# EAGLE design RAMI (EAGLE 9.3.0)
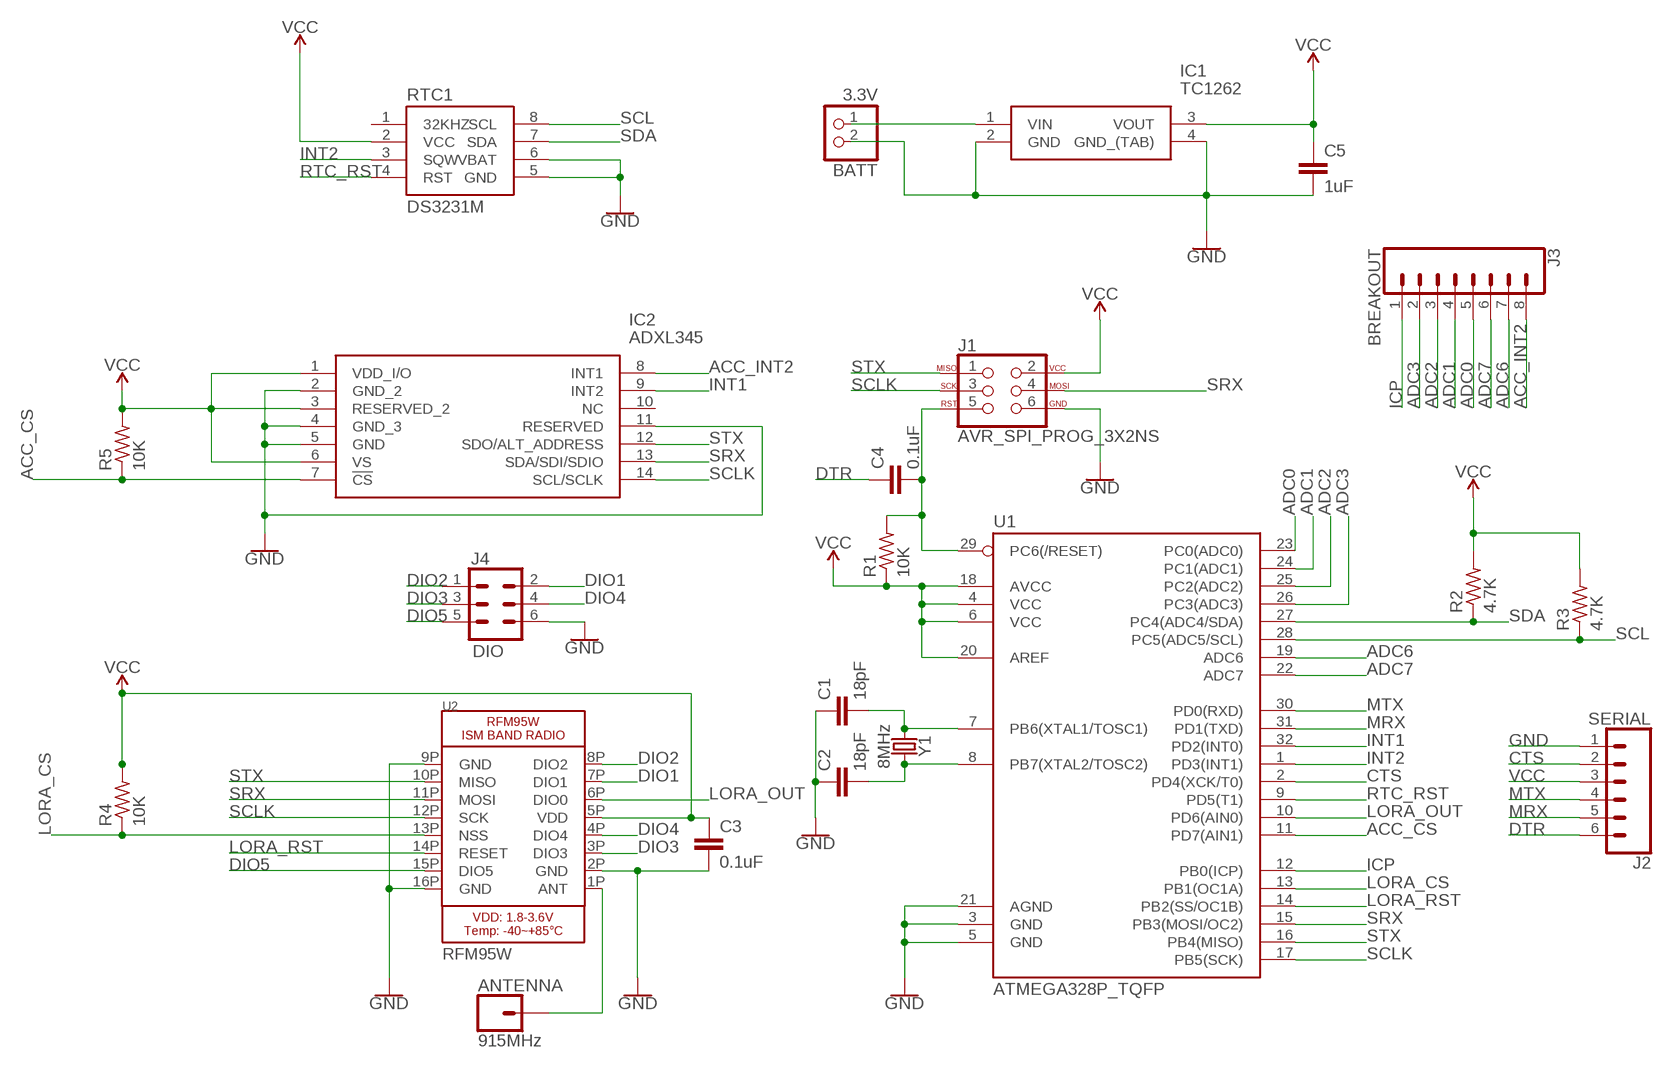
[diagram p0: schematic, sheet 1]

## Parts
ANTENNA  915MHz  CONN_01  [1X01]
BATT  3.3V  JST_2PIN-THM  [JST-PH-2-THM]
C1  18pF  18PF-0603-50V-5%  [0603]
C2  18pF  18PF-0603-50V-5%  [0603]
C3  0.1uF  0.1UF-0603-25V-5%  [0603]
C4  0.1uF  0.1UF-0603-25V-5%  [0603]
C5  1uF  C-EU050-024X044  [C050-024X044]
IC1  TC1262  TC1262-3.3VDB  [SOT230P700X180-4N]
IC2  ADXL345  ADXL345BCCZ  [LGA14R80P3X6_300X500X100]
J1  AVR_SPI_PROG_3X2NS  [2X3-NS]
J2  SERIAL  CONN_06LOCK  [1X06_LOCK]
J3  BREAKOUT  CONN_08"  [1X08]
J4  DIO  CONN_03X2NO_SILK  [2X3-NS]
R1  10K  R-US_R0603  [R0603]
R2  4.7K  R-US_R0603  [R0603]
R3  4.7K  R-US_R0603  [R0603]
R4  10K  R-US_R0603  [R0603]
R5  10K  R-US_R0603  [R0603]
RTC1  DS3231M  [SO08]
U1  ATMEGA328P_TQFP  [TQFP32-08]
U2  RFM95W  RFM95W_SMT  [RFM95W_SMT]
Y1  8MHz  CRYSTALPTH-HC49US  [HC49US]

## Nets
ACC_CS: IC2.7(!CS) R5.1 U1.11(PD7(AIN1))
ACC_INT2: IC2.8(INT1) J3.8
ADC0: J3.5 U1.23(PC0(ADC0))
ADC1: J3.4 U1.24(PC1(ADC1))
ADC2: J3.3 U1.25(PC2(ADC2))
ADC3: J3.2 U1.26(PC3(ADC3))
ADC6: J3.7 U1.19(ADC6)
ADC7: J3.6 U1.22(ADC7)
ANT: ANTENNA.1 U2.1P(ANT)
CTS: J2.2 U1.2(PD4(XCK/T0))
DIO1: J4.2 U2.7P(DIO1)
DIO2: J4.1 U2.8P(DIO2)
DIO3: J4.3 U2.3P(DIO3)
DIO4: J4.4 U2.4P(DIO4)
DIO5: J4.5 U2.15P(DIO5)
DTR: C4.1 J2.6
GND: BATT.2 C1.1 C2.1 C3.2 C5.2 IC1.2(GND) IC1.4(GND_(TAB)) IC2.2(GND_2) IC2.4(GND_3) IC2.5(GND) IC2.11(RESERVED) J1.6 J2.1 J4.6 RTC1.5(GND) RTC1.6(VBAT) U1.3(GND) U1.5(GND) U1.21(AGND) U2.2P(GND) U2.9P(GND) U2.16P(GND)
ICP: J3.1 U1.12(PB0(ICP))
INT1: IC2.9(INT2) U1.32(PD2(INT0))
INT2: RTC1.3(SQW) U1.1(PD3(INT1))
LORA_CS: R4.1 U1.13(PB1(OC1A)) U2.13P(NSS)
LORA_OUT: U1.10(PD6(AIN0)) U2.6P(DIO0)
LORA_RST: U1.14(PB2(SS/OC1B)) U2.14P(RESET)
MRX: J2.5 U1.31(PD1(TXD))
MTX: J2.4 U1.30(PD0(RXD))
N$2: C1.2 U1.7(PB6(XTAL1/TOSC1)) Y1.1
N$3: C2.2 U1.8(PB7(XTAL2/TOSC2)) Y1.2
N$4: BATT.1 IC1.1(VIN)
RST: C4.2 J1.5 R1.2 U1.29(PC6(/RESET))
RTC_RST: RTC1.4(RST) U1.9(PD5(T1))
SCL: R3.1 RTC1.8(SCL) U1.28(PC5(ADC5/SCL))
SCLK: IC2.14(SCL/SCLK) J1.3 U1.17(PB5(SCK)) U2.12P(SCK)
SDA: R2.1 RTC1.7(SDA) U1.27(PC4(ADC4/SDA))
SRX: IC2.13(SDA/SDI/SDIO) J1.4 U1.15(PB3(MOSI/OC2)) U2.11P(MOSI)
STX: IC2.12(SDO/ALT_ADDRESS) J1.1 U1.16(PB4(MISO)) U2.10P(MISO)
VCC: C3.1 C5.1 IC1.3(VOUT) IC2.1(VDD_I/O) IC2.3(RESERVED_2) IC2.6(VS) J1.2 J2.3 R1.1 R2.2 R3.2 R4.2 R5.2 RTC1.2(VCC) U1.4(VCC) U1.6(VCC) U1.18(AVCC) U1.20(AREF) U2.5P(VDD)
Unconnected: IC2.10(NC) RTC1.1(32KHZ)

## Library data of the parts
ANTENNA = SparkFun-Connectors:CONN_01: Single connection point. Often used as Generic Header-pin footprint for 0.1 inch spaced/style header connections On any of the 0.1 inch spaced packages, you can populate with these: Break Away Headers - Straight <https://www.sparkfun.com/products/116> (PRT-00116) Break Away Male Headers - Right Angle <https://www.sparkfun.com/products/553> (PRT-00553) Female Headers <https://www.sparkfun.com/products/115> (PRT-00115) Break Away Headers - Machine Pin <https://www.sparkfun.com/products/117> (PRT-00117) Break Away Female Headers - Swiss Machine Pin <https://www.sparkfun.com/products/743> (PRT-00743) This device is also useful as a general connection point to wire up your design to another part of your project. Our various solder wires solder well into these plated through hole pads. Hook-Up Wire - Assortment (Stranded, 22 AWG) <https://www.sparkfun.com/products/11375> (PRT-11375) Hook-Up Wire - Assortment (Solid Core, 22 AWG) <https://www.sparkfun.com/products/11367> (PRT-11367) View the entire wire category on our website here <https://www.sparkfun.com/categories/141> Special notes: SMTSO-256-ET is a "flush mount" nut for a 4-40 screw. We mostly use this on specialty testbeds; it is a nice way to connect hardware to your PCB at an adjustable hieght. Also note, the SNAP packages are for using a snappable style connector. We sell a baggie of snaps and they are also used on two LilyPad designs: Snap Assortment - 30 pack (male and female) <https://www.sparkfun.com/products/11347> (DEV-11347) LilyPad Arduino SimpleSnap <https://www.sparkfun.com/products/10941> (DEV-10941) LilyPad SimpleSnap Protoboard <https://www.sparkfun.com/products/10940> (DEV-10940)
BATT = adafruit:JST_2PIN: JST 2-Pin Connectors of various flavors SMT-RA (S2B-PH-SM4) 4UConnector #17311 SMT (B2B-PH-SM4) THM-RA (S2B-PH) THM (B2B-PH)
C1 C2 = SparkFun-Capacitors:18PF: 18pF ceramic capacitors A capacitor is a passive two-terminal electrical component used to store electrical energy temporarily in an electric field.; PROD_ID: CAP-08267
C3 C4 = SparkFun-Capacitors:0.1UF: 0.1µF ceramic capacitors A capacitor is a passive two-terminal electrical component used to store electrical energy temporarily in an electric field.; PROD_ID: CAP-08604
C5 = resistor:C-EU: CAPACITOR, European symbol
IC1 = SamacSys_Parts:TC1262-3.3VDB: TC1262-3.3VDB, Low Dropout Voltage Regulator, 0.5A, 3.3 V +/-0.5%, 2.7 6 Vin, 3-Pin SOT-223 Source: Datasheet <http://ww1.microchip.com/downloads/en/DeviceDoc/21373C.pdf>; ALLIED_NUMBER: 70414587; ALLIED_PRICE-STOCK: http://www.alliedelec.com/microchip-technology-inc-tc1262-3-3vdb/70414587/; DESCRIPTION: TC1262-3.3VDB, Low Dropout Voltage Regulator, 0.5A, 3.3 V +/-0.5%, 2.7 6 Vin, 3-Pin SOT-223; HEIGHT: 1.8mm; MANUFACTURER_NAME: Microchip; MANUFACTURER_PART_NUMBER: TC1262-3.3VDB; MOUSER_PART_NUMBER: 579-TC1262-3.3VDB; MOUSER_PRICE-STOCK: https://www.mouser.com/Search/Refine.aspx?Keyword=579-TC1262-3.3VDB; RS_PART_NUMBER: 9115732; RS_PRICE-STOCK: http://uk.rs-online.com/web/p/products/9115732
IC2 = SamacSys_Parts:ADXL345BCCZ: ADXL345BCCZ, Accelerometer 3-Axis, 0.1 3200 Hz 2 3.6 V, 14-Pin LGA Source: Datasheet <http://componentsearchengine.com/Datasheets/1/ADXL345BCCZ.pdf>; DESCRIPTION: ADXL345BCCZ, Accelerometer 3-Axis, 0.1 3200 Hz 2 3.6 V, 14-Pin LGA; HEIGHT: mm; MANUFACTURER_NAME: Analog Devices; MANUFACTURER_PART_NUMBER: ADXL345BCCZ; MOUSER_PART_NUMBER: 584-ADXL345BCCZ; MOUSER_PRICE-STOCK: https://www.mouser.com/Search/Refine.aspx?Keyword=584-ADXL345BCCZ; RS_PART_NUMBER: 7098439P; RS_PRICE-STOCK: http://uk.rs-online.com/web/p/products/7098439P
J1 = SparkFun-Connectors:AVR_SPI_PROG_3X2: AVR ISP 6 Pin This is the reduced ISP connector for AVR programming. Common on Arduino. This footprint will take up less PCB space and can be used with a 10-pin to 6-pin adapter such as SKU: BOB-08508 **Special note about "TEST_POINT" package. The stop mask is on the top side, so if you want your programming test points to be on the bottom of your board, make sure to place this package on the bottom side of the board. This also ensure that the orientation to program from the bottom side will be correct. SparkFun Products: SparkFun ISP Pogo Adapter <https://www.sparkfun.com/products/11591> - NS Tiny AVR Programmer <https://www.sparkfun.com/products/11801> -PTH
J2 = SparkFun-Connectors:CONN_06: Multi connection point. Often used as Generic Header-pin footprint for 0.1 inch spaced/style header connections On any of the 0.1 inch spaced packages, you can populate with these: Break Away Headers - Straight <https://www.sparkfun.com/products/116> (PRT-00116) Break Away Male Headers - Right Angle <https://www.sparkfun.com/products/553> (PRT-00553) Female Headers <https://www.sparkfun.com/products/115> (PRT-00115) Break Away Headers - Machine Pin <https://www.sparkfun.com/products/117> (PRT-00117) Break Away Female Headers - Swiss Machine Pin <https://www.sparkfun.com/products/743> (PRT-00743) Arduino Stackable Header - 6 Pin <https://www.sparkfun.com/products/9280> (PRT-09280) For SCREWTERMINALS and SPRING TERMINALS visit here: Screw Terimnals on SparkFun.com <https://www.sparkfun.com/search/results?term=Screw+Terminals> (5mm/3.5mm/2.54mm spacing) This device is also useful as a general connection point to wire up your design to another part of your project. Our various solder wires solder well into these plated through hole pads. Hook-Up Wire - Assortment (Stranded, 22 AWG) <https://www.sparkfun.com/products/11375> (PRT-11375) Hook-Up Wire - Assortment (Solid Core, 22 AWG) <https://www.sparkfun.com/products/11367> (PRT-11367) View the entire wire category on our website here <https://www.sparkfun.com/categories/141>
J3 = SparkFun-Connectors:CONN_08: Multi connection point. Often used as Generic Header-pin footprint for 0.1 inch spaced/style header connections On any of the 0.1 inch spaced packages, you can populate with these: Break Away Headers - Straight <https://www.sparkfun.com/products/116> (PRT-00116) Break Away Male Headers - Right Angle <https://www.sparkfun.com/products/553> (PRT-00553) Female Headers <https://www.sparkfun.com/products/115> (PRT-00115) Break Away Headers - Machine Pin <https://www.sparkfun.com/products/117> (PRT-00117) Break Away Female Headers - Swiss Machine Pin <https://www.sparkfun.com/products/743> (PRT-00743) Arduino Stackable Header - 8 Pin <https://www.sparkfun.com/products/9279> (PRT-09279) For SCREWTERMINALS and SPRING TERMINALS visit here: Screw Terimnals on SparkFun.com <https://www.sparkfun.com/search/results?term=Screw+Terminals> (5mm/3.5mm/2.54mm spacing) This device is also useful as a general connection point to wire up your design to another part of your project. Our various solder wires solder well into these plated through hole pads. Hook-Up Wire - Assortment (Stranded, 22 AWG) <https://www.sparkfun.com/products/11375> (PRT-11375) Hook-Up Wire - Assortment (Solid Core, 22 AWG) <https://www.sparkfun.com/products/11367> (PRT-11367) View the entire wire category on our website here <https://www.sparkfun.com/categories/141> Special notes: Molex polarized connector foot print use with SKU : PRT-08231 with associated crimp pins and housings. 1MM SMD Version SKU: PRT-10208 NOTES ON THE VARIANTS LOCK and LOCK_LONGPADS... This footprint was designed to help hold the alignment of a through-hole component (i.e. 6-pin header) while soldering it into place. You may notice that each hole has been shifted either up or down by 0.005 of an inch from it's more standard position (which is a perfectly straight line). This slight alteration caused the pins (the squares in the middle) to touch the edges of the holes. Because they are alternating, it causes a "brace" to hold the component in place. 0.005 has proven to be the perfect amount of "off-center" position when using our standard breakaway headers. Although looks a little odd when you look at the bare footprint, once you have a header in there, the alteration is very hard to notice. Also,if you push a header all the way into place, it is covered up entirely on the bottom side.; PROD_ID: CONN-08438
J4 = SparkFun-Connectors:CONN_03X2: Multi connection point. Often used as Generic Header-pin footprint for 0.1 inch spaced/style header connections You can populate with any combo of single row headers, but if you'd like an exact match, check these: Header - 2x3 (Male, 0.1") <https://www.sparkfun.com/products/12807> (PRT-12807) Header - 2x3 (Female, 0.1") <https://www.sparkfun.com/products/13010> (PRT-13010) 2x3 Pin Shrouded Header <https://www.sparkfun.com/products/10877> (PRT-10877) On any of the 0.1 inch spaced packages, you can populate with these: Break Away Headers - Straight <https://www.sparkfun.com/products/116> (PRT-00116) Break Away Male Headers - Right Angle <https://www.sparkfun.com/products/553> (PRT-00553) Female Headers <https://www.sparkfun.com/products/115> (PRT-00115) Break Away Headers - Machine Pin <https://www.sparkfun.com/products/117> (PRT-00117) Break Away Female Headers - Swiss Machine Pin <https://www.sparkfun.com/products/743> (PRT-00743) Special note: the shrouded connector mates well with our 3x2 ribbon cables: Ribbon Crimp Connector - 6-pin (2x3, Female) <https://www.sparkfun.com/products/10651> (PRT-10651) Ribbon Cable - 6 wire (15ft) <https://www.sparkfun.com/products/10646> (PRT-10646)
R1-R5 = resistor:R-US_: RESISTOR, American symbol
RTC1 = SparkFun-Clocks:DS3231M: DS3231M Real Time Clock Accuracy +/-5ppm. Battery Backup. 2.3V to 5.5V. Datasheet <https://cdn.sparkfun.com/datasheets/Dev/Beagle/DS3231M.pdf> SparkFun Products CryptoCape <https://www.sparkfun.com/products/12773> (DEV-12773) SparkFun CryptoShield <https://www.sparkfun.com/products/13183> (DEV-13183); PROD_ID: IC-11985
U1 = SparkFun-IC-Microcontroller:ATMEGA328P_TQFP: Popular 328P in QFP Storefront component: ATmega328 - TQFP <https://www.sparkfun.com/products/13448> (COM-13448) Datasheet <http://www.sparkfun.com/datasheets/Components/SMD/ATMega328.pdf> SparkFun Products SparkFun RedBoard - Programmed with Arduino <https://www.sparkfun.com/products/12757> (DEV-12757) Arduino Pro Mini 328 - 5V/16MHz <https://www.sparkfun.com/products/11113> (DEV-11113) Arduino Pro Mini 328 - 3.3V/8MHz <https://www.sparkfun.com/products/11114> (DEV-11114) SparkFun OpenLog <https://www.sparkfun.com/products/13712> (DEV-13712) SparkFun MicroView - OLED Arduino Module <https://www.sparkfun.com/products/12923> (DEV-12923) SparkFun Digital Sandbox <https://www.sparkfun.com/products/12651> (DEV-12651) SparkFun PicoBoard <https://www.sparkfun.com/products/11888> (WIG-11888) Arduino Fio <https://www.sparkfun.com/products/10116> (DEV-10116) LilyPad Arduino 328 Main Board <https://www.sparkfun.com/products/13342> (DEV-13342) SparkFun RedStick <https://www.sparkfun.com/products/13741> (DEV-13741) LilyPad MP3 <https://www.sparkfun.com/products/11013> (DEV-11013) LilyPad Arduino SimpleSnap <https://www.sparkfun.com/products/10941> (DEV-10941) SparkFun Stepoko <https://www.sparkfun.com/products/13899> (ROB-13899) SparkFun Geiger Counter <https://www.sparkfun.com/products/11345> (SEN-11345) SparkFun EL Sequencer <https://www.sparkfun.com/products/12781> (COM-12781) Arduino Pro 328 - 5V/16MHz <https://www.sparkfun.com/products/10915> (DEV-10915) CryptoCape <https://www.sparkfun.com/products/12773> (DEV-12773) SparkFun IR Thermometer Evaluation Board - MLX90614 <https://www.sparkfun.com/products/10740> (SEN-10740) SparkFun RedBot Mainboard <https://www.sparkfun.com/products/12097> (ROB-12097) Arduino Pro 328 - 3.3V/8MHz <https://www.sparkfun.com/products/10914> (DEV-10914) SparkFun Block for Intel® Edison - Arduino <https://www.sparkfun.com/products/13036> (DEV-13036) SparkFun Simon Says - Surface Mount Soldering Kit <https://www.sparkfun.com/products/10935> (KIT-10935) SparkFun 7-Segment Serial Display - Red <https://www.sparkfun.com/products/11441> (COM-11441) SparkFun 7-Segment Serial Display - White <https://www.sparkfun.com/products/11629> (COM-11629) SparkFun 7-Segment Serial Display - Yellow <https://www.sparkfun.com/products/11443> (COM-11443) SparkFun 7-Segment Serial Display - Kelly Green <https://www.sparkfun.com/products/11440> (COM-11440) SparkFun 7-Segment Serial Display - Blue <https://www.sparkfun.com/products/11442> (COM-11442) SparkFun OpenSegment Serial Display - 20mm (Blue) <https://www.sparkfun.com/products/11647> (COM-11647) SparkFun OpenSegment Serial Display - 20mm (Green) <https://www.sparkfun.com/products/11646> (COM-11646) SparkFun OpenSegment Serial Display - 20mm (White) <https://www.sparkfun.com/products/11648> (COM-11648) SparkFun OpenSegment Serial Display - 20mm (Red) <https://www.sparkfun.com/products/11644> (COM-11644) SparkFun OpenSegment Serial Display - 20mm (Yellow) <https://www.sparkfun.com/products/11645> (COM-11645) SparkFun OpenSegment Shield <https://www.sparkfun.com/products/13190> (DEV-13190); PROD_ID: IC-09069
U2 = Personal:RFM95W: RFM69HCW - ISM Band RF Transceiver
Y1 = SparkFun-Clocks:CRYSTAL: Crystals (Generic) These are passive quartz crystals, which can be used as a clock source for a microcontroller. Crystal's are two-terminal devices. They require external "load" capacitors to generate an oscillating signal.

## Net classes
0 default: clearance 0.205 mm

## Board
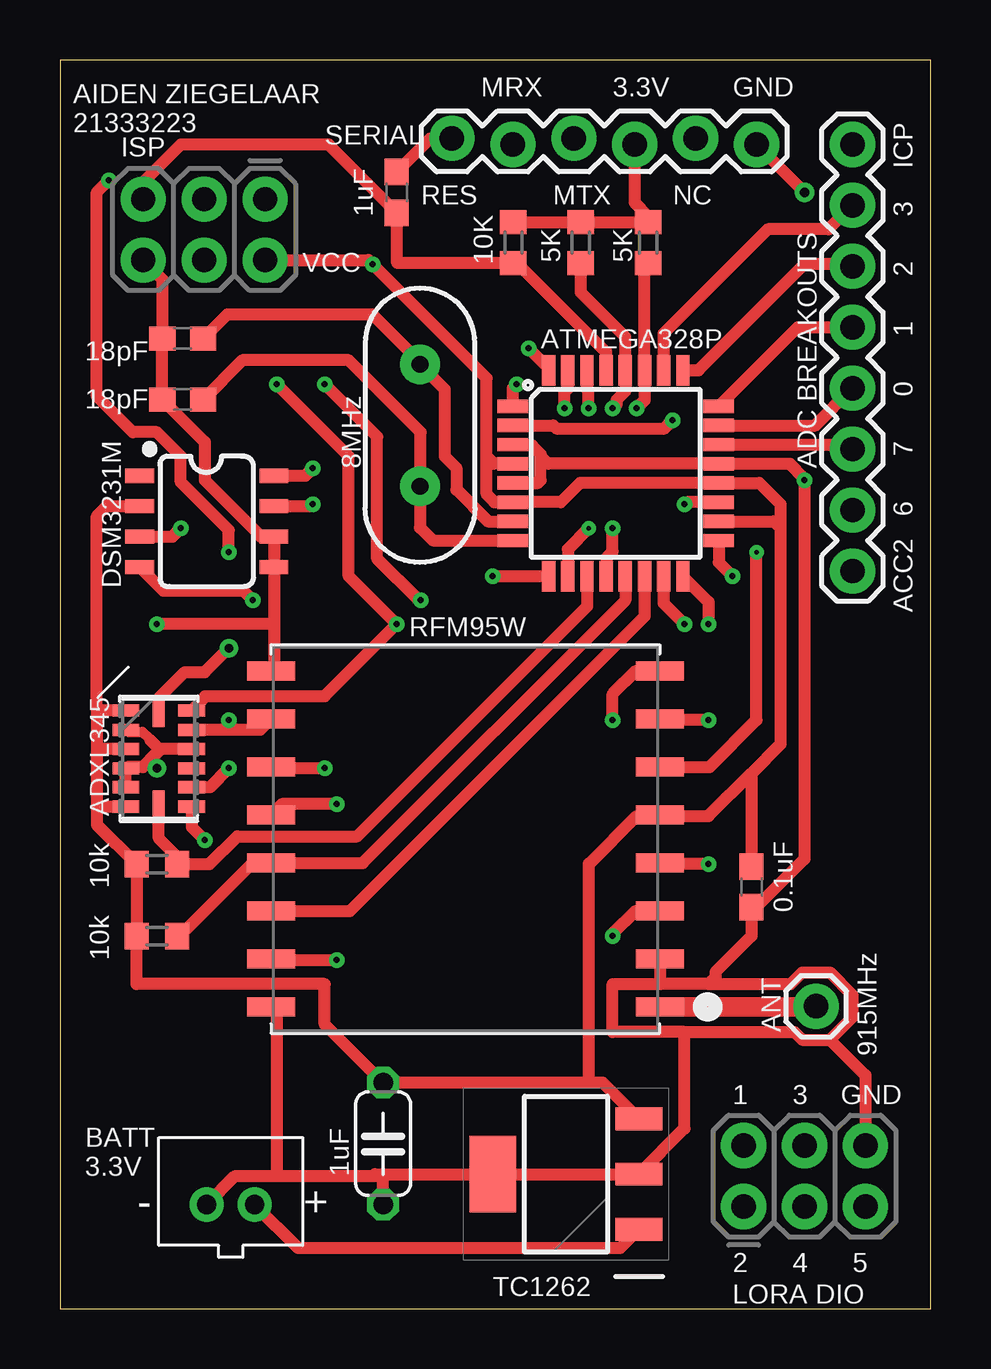
[diagram p1: board, top side]
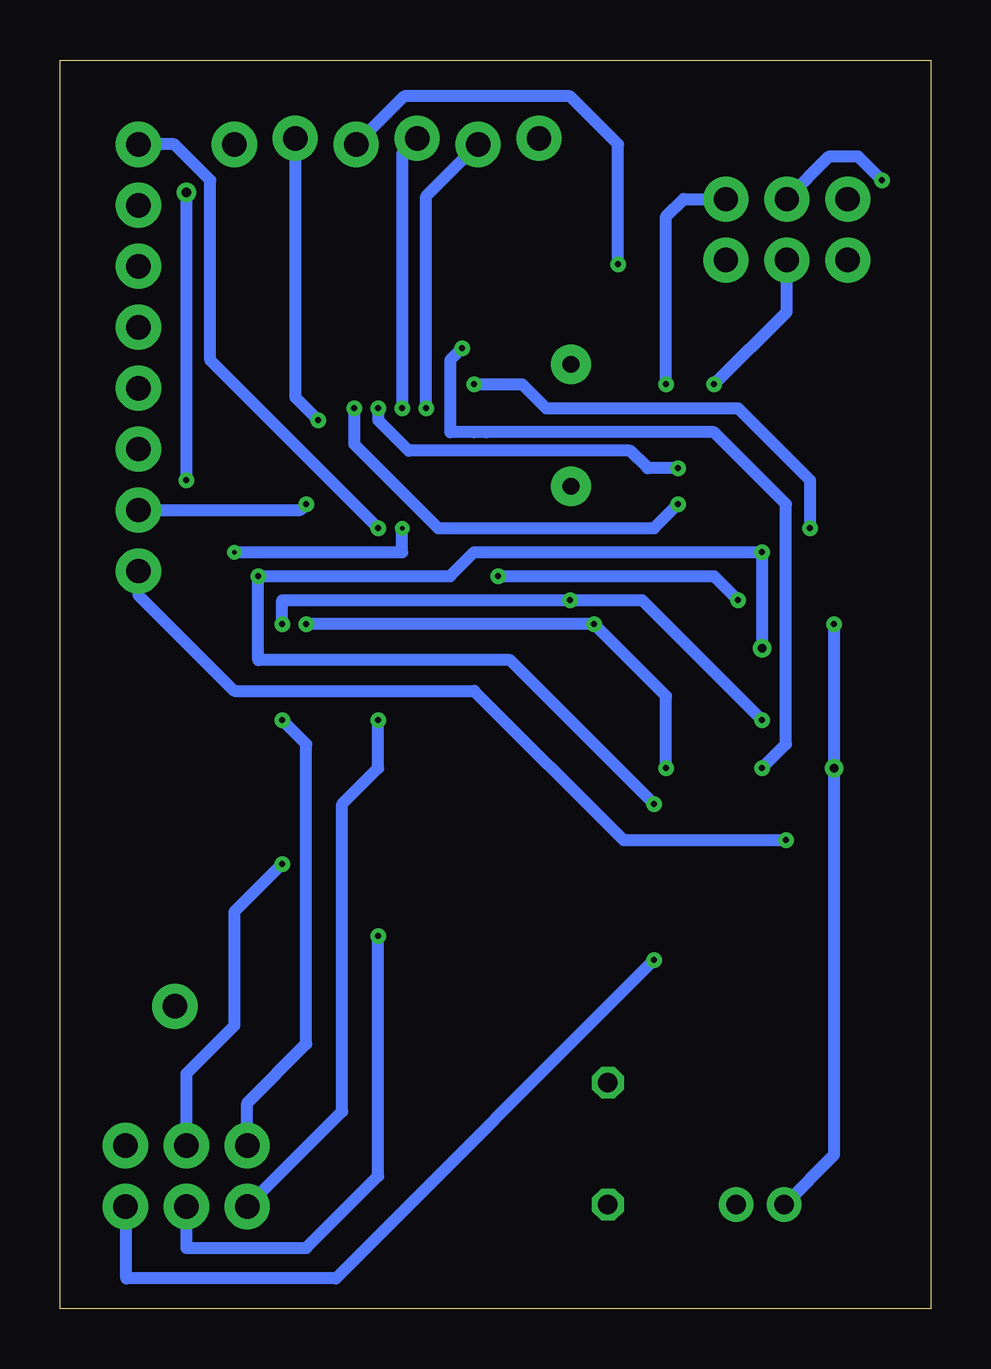
[diagram p2: board, bottom side, seen from below]

Size 36.31 x 52.06 mm. Coordinates in mm from the lower left corner, seen from the top.
Outline: 0,0 36.31,0 36.31,52.06 0,52.06 0,0
Copper layers (1*16): Top 0.035mm / dielectric 1.5mm / Bottom 0.035mm
Design rules "untitled *": minimum track width 20mil, minimum drill 2mil, track to track 10mil, track to pad 0.205mm, pad to pad 0.205mm, via to via 10mil, smd to smd 6mil, copper to edge 40mil, drill to drill 6mil, minimum pad ring 10mil, minimum via ring 8mil, stop-mask expansion 4mil, vias tented up to drill 0mil, thermal gap 10mil

### Footprints (pad centres in the part's own frame; a part is rotated, then mirrored left to right if it is on the bottom)
1X01 = drill 1.016 pad 1.88: 1 0,0
JST-PH-2-THM = drill 0.8 pad 1.422: 1 1,0; 2 -1,0
0603 = smd 1.1 x 1: 1 -0.85,0; 2 0.85,0
C050-024X044 = drill 0.813 octagon: 1 -2.54,0; 2 2.54,0
SOT230P700X180-4N = smd 1.95 x 0.95: 1 -3.05,2.3; 2 -3.05,0; 3 -3.05,-2.3 | smd 1.95 x 3.2: 4 3.05,0
LGA14R80P3X6_300X500X100 = smd 1.118 x 0.508: 1 -1.372,2.007; 2 -1.372,1.194; 3 -1.372,0.406; 4 -1.372,-0.406; 5 -1.372,-1.194; 6 -1.372,-2.007; 8 1.372,-2.007; 9 1.372,-1.194; 10 1.372,-0.406; 11 1.372,0.406; 12 1.372,1.194; 13 1.372,2.007 | smd 0.508 x 1.118: 7 0,-1.88; 14 0,1.88
2X3-NS = drill 1.016 pad 1.88: 1 -2.54,-1.27; 2 -2.54,1.27; 3 0,-1.27; 4 0,1.27; 5 2.54,-1.27; 6 2.54,1.27
1X06_LOCK = drill 1.016 pad 1.88: 1 0,0; 2 2.54,-0.254; 3 5.08,0; 4 7.62,-0.254; 5 10.16,0; 6 12.7,-0.254
1X08 = drill 1.016 pad 1.88: 1 0,0; 2 2.54,0; 3 5.08,0; 4 7.62,0; 5 10.16,0; 6 12.7,0; 7 15.24,0; 8 17.78,0
R0603 = smd 1 x 1.1: 1 -0.85,0; 2 0.85,0
SO08 = smd 0.6 x 1.2: 1 -1.905,-2.8; 2 -0.635,-2.8; 3 0.635,-2.8; 4 1.905,-2.8; 5 1.905,2.8; 6 0.635,2.8; 7 -0.635,2.8; 8 -1.905,2.8
TQFP32-08 = smd 1.27 x 0.559: 1 -4.293,2.8; 2 -4.293,2; 3 -4.293,1.2; 4 -4.293,0.4; 5 -4.293,-0.4; 6 -4.293,-1.2; 7 -4.293,-2; 8 -4.293,-2.8; 17 4.293,-2.8; 18 4.293,-2; 19 4.293,-1.2; 20 4.293,-0.4; 21 4.293,0.4; 22 4.293,1.2; 23 4.293,2; 24 4.293,2.8 | smd 0.559 x 1.27: 9 -2.8,-4.293; 10 -2,-4.293; 11 -1.2,-4.293; 12 -0.4,-4.293; 13 0.4,-4.293; 14 1.2,-4.293; 15 2,-4.293; 16 2.8,-4.293; 25 2.8,4.293; 26 2,4.293; 27 1.2,4.293; 28 0.4,4.293; 29 -0.4,4.293; 30 -1.2,4.293; 31 -2,4.293; 32 -2.8,4.293
RFM95W_SMT = smd 2 x 0.8: 1P 8.1,-7; 2P 8.1,-5; 3P 8.1,-3; 4P 8.1,-1; 5P 8.1,1; 6P 8.1,3; 7P 8.1,5; 8P 8.1,7; 9P -8.1,7; 10P -8.1,5; 11P -8.1,3; 12P -8.1,1; 13P -8.1,-1; 14P -8.1,-3; 15P -8.1,-5; 16P -8.1,-7
HC49US = drill 0.7 pad 1.651: 1 -2.54,0; 2 2.54,0

### Placement (x,y rotation side)
ANTENNA  31.52,12.62 0 top
BATT  7.12,4.35 0 top
C1  5.12,40.45 0 top
C2  5.12,37.91 0 top
C3  28.83,17.59 270 top
C4  14.04,46.54 270 top
C5  13.47,6.89 270 top
IC1  21.09,5.62 180 top
IC2  4.12,22.94 0 top
J1  6.01,44.99 180 top
J2  29.04,48.54 180 top
J3  33.04,48.54 270 top
J4  31.04,5.54 0 top
R1  18.9,44.45 270 top
R2  24.52,44.45 90 top
R3  21.71,44.45 90 top
R4  4.04,15.54 180 top
R5  4.04,18.54 180 top
RTC1  6.12,32.83 270 top
U1  23.17,34.83 0 top
U2  16.9,19.59 0 top
Y1  15.01,36.83 270 top

### Tracks (layer width: path | path; a pad name or v marks a point on that pad's centre or on a via)
ACC_CS
  Top 0.508: IC2.7 4.12,19.62 4.89,18.85 R5.1 6.22,18.54 7.39,19.7 12.39,19.7 21.97,29.29 U1.11
ACC_INT2  (via drill 0.25 pad 0.6)
  Top 0.508: v6.04,19.54 5.49,20.09 IC2.8
  Bottom 0.508: J3.8 33.04,29.76 29.04,25.76 19.04,25.76 12.82,19.54 v6.04,19.54
ADC0
  Top 0.508: U1.23 31.49,36.83 J3.5
ADC1
  Top 0.508: U1.24 30.75,40.92 J3.4
ADC2
  Top 0.508: J3.3 32.96,43.54 31.04,43.54 26.62,39.12 U1.25
ADC3
  Top 0.508: U1.26 25.17,40.67 29.5,45 32.04,45 J3.2
ADC6  (via drill 0.25 pad 0.6)
  Top 0.508: U1.19 26.13,33.63 v26.04,33.54
  Bottom 0.508: J3.7 26.28,33.3 v26.04,33.54
ADC7
  Top 0.508: U1.22 32.85,36.03 J3.6
ANT
  Top 0.508: 31.49,12.59 ANTENNA.1
  Top 0.813: U2.1P 31.49,12.59
CTS  (via drill 0.25)
  Top 0.508: U1.2 20.57,36.83 20.69,36.7 25.2,36.7 v25.54,37.04
  Bottom 0.508: J2.2 26.5,38 v25.54,37.04
DIO1  (via drill 0.25)
  Top 0.508: v27.04,24.54 25.05,24.54 U2.7P
  Bottom 0.508: J4.2 28.5,8.58 26.04,11.04 26.04,23.54 v27.04,24.54
DIO2  (via drill 0.25)
  Top 0.508: U2.8P 24,26.59 23.04,25.63 v23.04,24.54
  Bottom 0.508: J4.1 24.54,8.23 24.54,21.04 23.04,22.54 v23.04,24.54
DIO3  (via drill 0.25)
  Top 0.508: U2.3P 24,16.59 23.04,15.63 v23.04,15.54
  Bottom 0.508: J4.3 31.04,2.54 26.04,2.54 23.04,5.54 v23.04,15.54
DIO4  (via drill 0.25)
  Top 0.508: v27.04,18.54 25.05,18.54 U2.4P
  Bottom 0.508: v27.04,18.54 29.04,16.54 29.04,11.81 31.04,9.81 J4.4
DIO5  (via drill 0.25)
  Top 0.508: U2.15P 8.85,14.54 v11.54,14.54
  Bottom 0.508: v11.54,14.54 24.81,1.27 33.54,1.27 33.54,4.23 J4.5
DTR
  Top 0.508: C4.1 15.44,48.79 J2.6
GND  (via drill 0.25 pad 0.6, 0.35 pad 0.7, 0.4 pad 0.8)
  Top 0.406: 3.77,23.71 3.71,23.76 3.71,23.77 3.43,24.06 2.83,24.06 IC2.2
  Top 0.508: 9.04,5.54 13.04,5.54 | 13.04,5.54 13.47,5.54 C5.2 | 26.04,11.54 26.04,7.52 IC1.2 IC1.4 13.12,5.62 13.04,5.54 | 26.04,11.54 23.04,11.54 23.04,13.54 25.04,13.54 | 27.04,13.54 25.04,13.54 | 25.04,13.54 25.04,14.55 U2.2P | 27.04,13.54 27.33,13.83 27.33,14.04 28.83,15.54 28.83,16.54 | J1.6 4.27,42.92 C1.1 C2.1 6.04,36.14 6.04,34.54 8.38,32.2 RTC1.6 RTC1.5 8.92,28.54 | IC2.5 IC2.4 2.8,22.58 3.45,22.58 3.72,22.86 | IC2.11 4.21,23.35 | 4.21,23.35 3.72,22.86 | v4.04,22.54 3.72,22.86 | U2.16P 9.04,12.35 9.04,5.54 | U1.5 19.93,34.43 20.04,34.54 20.04,35.54 | U1.3 18.91,35.99 19.68,35.99 20.04,35.63 20.04,35.54 | 20.04,35.54 20.35,35.23 U1.21 30.43,35.23 31.04,34.62 v31.04,34.54 31.04,18.75 28.83,16.54 | C3.2 28.83,16.54 | 8.92,28.54 8.92,26.71 U2.9P | 8.92,28.54 v4.04,28.54 | BATT.2 7.31,5.54 9.04,5.54 | 32.1,11.22 30.94,11.22 30.62,11.54 26.04,11.54 | 32.1,11.22 33.04,12.16 33.04,13.08 32.1,14.02 30.94,14.02 30.46,13.54 27.04,13.54 | J2.1 v31.04,46.54 | 32.1,11.22 33.58,9.74 J4.6 | 4.21,23.35 4.13,23.35 3.77,23.71
  Bottom 0.508: BATT.2 4.04,6.43 v4.04,22.54 v4.04,28.54 | v31.04,46.54 v31.04,34.54
ICP  (via drill 0.25 pad 0.6)
  Top 0.508: v23.04,32.54 23.04,31.57 22.81,31.34 22.81,30.57 U1.12
  Bottom 0.508: v23.04,32.54 30.04,39.54 30.04,47.04 31.54,48.54 J3.1
INT1  (via drill 0.25 pad 0.6)
  Top 0.508: v7.04,22.54 6.25,21.75 IC2.9 | v19.54,40.04 20.37,39.21 U1.32
  Bottom 0.508: v7.04,22.54 6.04,23.54 6.04,33.54 9.04,36.54 18.54,36.54 19.04,36.54 20.04,36.54 20.04,39.54 v19.54,40.04
INT2  (via drill 0.25 pad 0.6)
  Top 0.508: RTC1.3 4.7,32.2 v5.04,32.54 | U1.1 18.88,38.38 v19.04,38.54
  Bottom 0.508: v19.04,38.54 17.04,38.54 16.04,37.54 8.04,37.54 5.04,34.54 v5.04,32.54
LORA_CS
  Top 0.508: R4.1 4.99,15.54 8.04,18.59 U2.13P 12.62,18.59 23.57,29.54 U1.13
LORA_OUT  (via drill 0.2)
  Top 0.508: v22.04,32.54 21.17,31.67 U1.10 | U2.6P 27.09,22.59 29.04,24.54 v29.04,31.54
  Bottom 0.508: v29.04,31.54 22.04,31.54 v22.04,32.54
LORA_RST
  Top 0.254: 24.37,28.87 24.33,28.83
  Top 0.508: U1.14 24.37,28.87 | 24.33,28.83 12.09,16.59 U2.14P
MRX  (via drill 0.25 pad 0.6)
  Top 0.254: 21.17,38.54 U1.31
  Top 0.508: v21.04,37.54 21.04,38.23 21.17,38.36 21.17,38.54
  Bottom 0.254: 18.96,48.46 J2.5
  Bottom 0.508: v21.04,37.54 21.04,46.38 18.96,48.46
MTX  (via drill 0.25 pad 0.6)
  Top 0.254: 21.97,38.54 U1.30
  Top 0.508: v22.04,37.54 22.04,38.29 21.97,38.36 21.97,38.54
  Bottom 0.508: J2.4 22.04,48.17 v22.04,37.54
N$2
  Top 0.508: U1.7 17.84,32.83 16.52,34.14 16.52,35.06 16.04,35.54 16.04,38.34 Y1.1 15.01,39.47 13.03,41.45 6.97,41.45 C1.2
N$3
  Top 0.508: U1.8 15.55,32.03 15.01,32.57 Y1.2 15.01,36.51 15.04,36.54 12.04,39.54 7.6,39.54 C2.2
N$4
  Top 0.508: BATT.1 9.93,2.54 23.36,2.54 IC1.1
RST
  Top 0.508: U1.29 22.77,39.89 19.06,43.6 R1.2 14.06,43.6 14.06,45.67 C4.2 11.2,48.53 5.04,48.53 3.47,46.96 J1.5
RTC_RST  (via drill 0.25 pad 0.6)
  Top 0.508: RTC1.4 4.32,29.93 7.66,29.93 v8.04,29.54 | U1.9 v18.04,30.54
  Bottom 0.508: v18.04,30.54 9.04,30.54 v8.04,29.54
SCL  (via drill 0.25)
  Top 0.508: R3.1 21.71,42.37 23.57,40.51 U1.28 23.57,38.25 23.2,37.89 23.2,37.7 v23.04,37.54 | RTC1.8 10.23,34.73 v10.54,35.04
  Bottom 0.508: v23.04,37.54 23.04,37.04 21.78,35.78 12.54,35.78 11.8,35.04 v10.54,35.04
SCLK  (via drill 0.25 pad 0.6, 0.35)
  Top 0.508: U1.17 27.46,31.12 v28.04,30.54 | v11.54,21.04 9.25,21.04 U2.12P | v7.04,31.54 7.04,32.46 5.04,34.46 5.04,35.54 4.04,36.54 3.04,36.54 1.54,38.04 1.54,46.54 v2.04,47.04 | v7.04,27.54 6.04,26.54 5.2,26.54 4.12,25.46 IC2.14
  Bottom 0.508: v11.54,21.04 17.54,27.04 28.04,27.04 v28.04,30.54 20.04,30.54 19.04,31.54 v7.04,31.54 v7.04,27.54 | v2.04,47.04 3.04,48.04 4.23,48.04 J1.3
SDA  (via drill 0.25)
  Top 0.508: R2.1 24.37,43.45 U1.27 24.37,37.87 v24.04,37.54 | RTC1.7 10.46,33.46 v10.54,33.54
  Bottom 0.508: v10.54,33.54 11.54,32.54 20.54,32.54 24.04,36.04 v24.04,37.54
SRX  (via drill 0.25 pad 0.6)
  Top 0.508: U2.11P 8.85,22.54 v11.04,22.54 | v9.04,38.54 12.04,35.54 12.04,30.54 v14.04,28.54 11.04,25.54 6.04,25.54 6.04,25.49 IC2.13 | v26.04,28.54 25.17,29.41 U1.15
  Bottom 0.508: v11.04,22.54 11.04,25.54 v14.04,28.54 v26.04,28.54 | v9.04,38.54 6.01,41.57 J1.4
STX  (via drill 0.25 pad 0.6)
  Top 0.508: U1.16 27.04,29.47 v27.04,28.54 | U2.10P 8.34,24.13 7.04,24.13 | 7.04,24.13 IC2.12 | v7.04,24.54 7.04,24.13 | v11.04,38.54 13.23,36.35 13.23,31.26 14.94,29.54 v15.04,29.54
  Bottom 0.508: v27.04,28.54 27.04,29.54 v15.04,29.54 12.04,29.54 v7.04,24.54 | v11.04,38.54 11.04,45.54 10.32,46.26 J1.1
VCC  (via drill 0.25 pad 0.6)
  Top 0.508: IC1.3 22.63,9.43 22.04,9.43 | 22.04,9.43 C5.1 11.04,11.86 11.04,13.54 3.19,13.54 R4.2 R5.2 1.54,20.19 1.54,20.93 | 28.83,22.33 C3.1 | 22.04,9.43 22.04,18.55 22.05,18.55 24.04,20.54 24.95,20.54 U2.5P 25.05,20.54 27.04,20.54 28.83,22.33 | IC2.1 1.54,24.95 | 1.54,23.35 1.54,20.93 | IC2.3 1.54,23.35 | IC2.6 1.54,20.93 | 30.04,32.54 30.04,33.54 29.15,34.43 U1.20 21.68,34.43 20.88,33.63 U1.6 18.11,33.63 17.78,33.96 17.78,35.54 | 30.04,32.54 30.04,23.54 28.83,22.33 | U1.18 29.75,32.83 30.04,32.54 | J1.2 12.86,43.72 v13.04,43.54 17.78,38.8 17.78,35.54 | 1.54,24.95 1.54,33.04 2.04,33.54 2.12,33.46 RTC1.2 | U1.4 18.09,35.23 17.78,35.54 | R1.1 R3.2 R2.2 24.52,45.56 23.96,46.12 J2.3 | 1.54,24.95 1.54,23.35
  Bottom 0.508: J2.3 21.96,50.54 15.04,50.54 13.04,48.54 v13.04,43.54

### Text on the board
tPlace: 10k | 0.1uF | 10k | BATT / 3.3V | 1uF
_tsilk: MRX | 3.3V | GND | AIDEN ZIEGELAAR / 21333223 | ISP | SERIAL | ICP | RES | MTX | NC | 1uF | 3 | VCC | 5K | 5K | 10K | 2 | ATMEGA328P | 1 | 18pF | 0 | 18pF | 7 | 8MHz | ADC BREAKOUTS | 6 | DSM3231M | RFM95W | ACC2 | ADXL345 | ANT | 915MHz | 1 | 3 | GND | 2 | 4 | 5 | TC1262 | LORA DIO